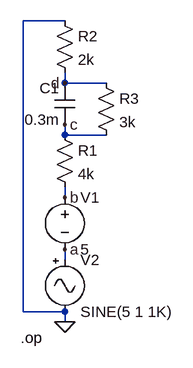
[diagram p0: schematic capacitorDCoof.asc]
capacitorDCoof.asc, the LTspice schematic file:
Version 4
SHEET 1 880 680
WIRE 208 -64 144 -64
WIRE 208 32 208 16
WIRE 272 32 208 32
WIRE 208 112 208 96
WIRE 272 112 208 112
WIRE 208 208 208 192
WIRE 208 304 208 288
WIRE 144 384 144 -64
WIRE 208 384 144 384
WIRE 208 400 208 384
FLAG 208 400 0
FLAG 208 288 a
FLAG 208 208 b
FLAG 208 96 c
FLAG 208 32 d
SYMBOL voltage 208 192 R0
SYMATTR InstName V1
SYMATTR Value 5
SYMBOL res 192 96 R0
SYMATTR InstName R1
SYMATTR Value 4k
SYMBOL cap 224 96 R180
WINDOW 0 24 56 Left 2
WINDOW 3 24 8 Left 2
SYMATTR InstName C1
SYMATTR Value 0.3m
SYMBOL res 192 -80 R0
SYMATTR InstName R2
SYMATTR Value 2k
SYMBOL Misc\\signal 208 288 R0
SYMATTR InstName V2
SYMATTR Value SINE(5 1 1K)
SYMBOL res 256 16 R0
SYMATTR InstName R3
SYMATTR Value 3k
TEXT 140 424 Left 2 !.op

The netlist it stands for:
* capacitorDCoof.asc
V1 b a 5
R1 c b 4k
C1 c d 0.3m
R2 0 d 2k
V2 a 0 SINE(5 1 1K)
R3 d c 3k
.op
.backanno
.end

* Results of the author's LTspice run, read from the files saved beside the schematic
* Operating Point:
*   V(b) = 10 V
*   V(a) = 5 V
*   V(c) = 5.556 V
*   V(d) = 2.222 V
*   I(C1) = 1 fA
*   I(R3) = -1.111 mA
*   I(R2) = -1.111 mA
*   I(R1) = -1.111 mA
*   I(V2) = -1.111 mA
*   I(V1) = -1.111 mA